# EasyEDA schematic demo-project.json
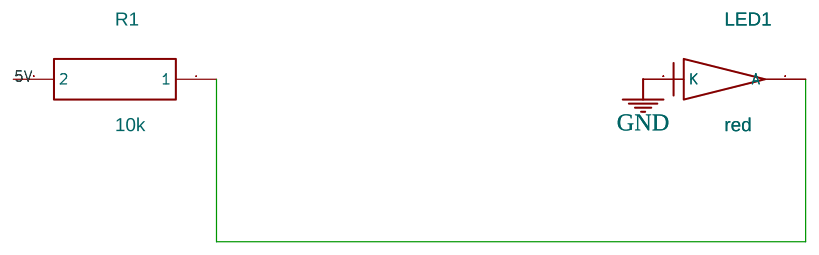
[diagram p0: schematic sheet]

## Parts
LED1  red
R1  10k

## Library data of the parts
LED1 = led
R1 = resistor

## Nets
5V: R1.2
GND: LED1.2(K)
Net-(LED1-1): LED1.1(A) R1.1
